# EAGLE schematic shematic (EAGLE 9.6.2)
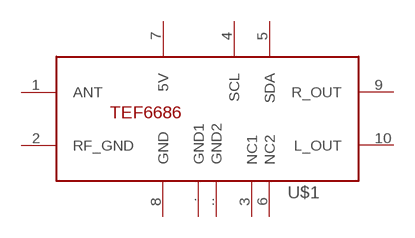
[diagram p0: schematic, sheet 1]

## Parts
U$1  TEF6686  [TEF6686]
Unconnected: U$1.1(ANT) U$1.2(RF_GND) U$1.3(NC1) U$1.4(SCL) U$1.5(SDA) U$1.6(NC2) U$1.7(5V) U$1.8(GND) U$1.9(R_OUT) U$1.10(L_OUT) U$1..(GND1) U$1...(GND2)

## Library data of the parts
U$1 = TEF6686:TEF6686: Library for TEF6686 tuner created by Nicu FLORICA (niq_ro)